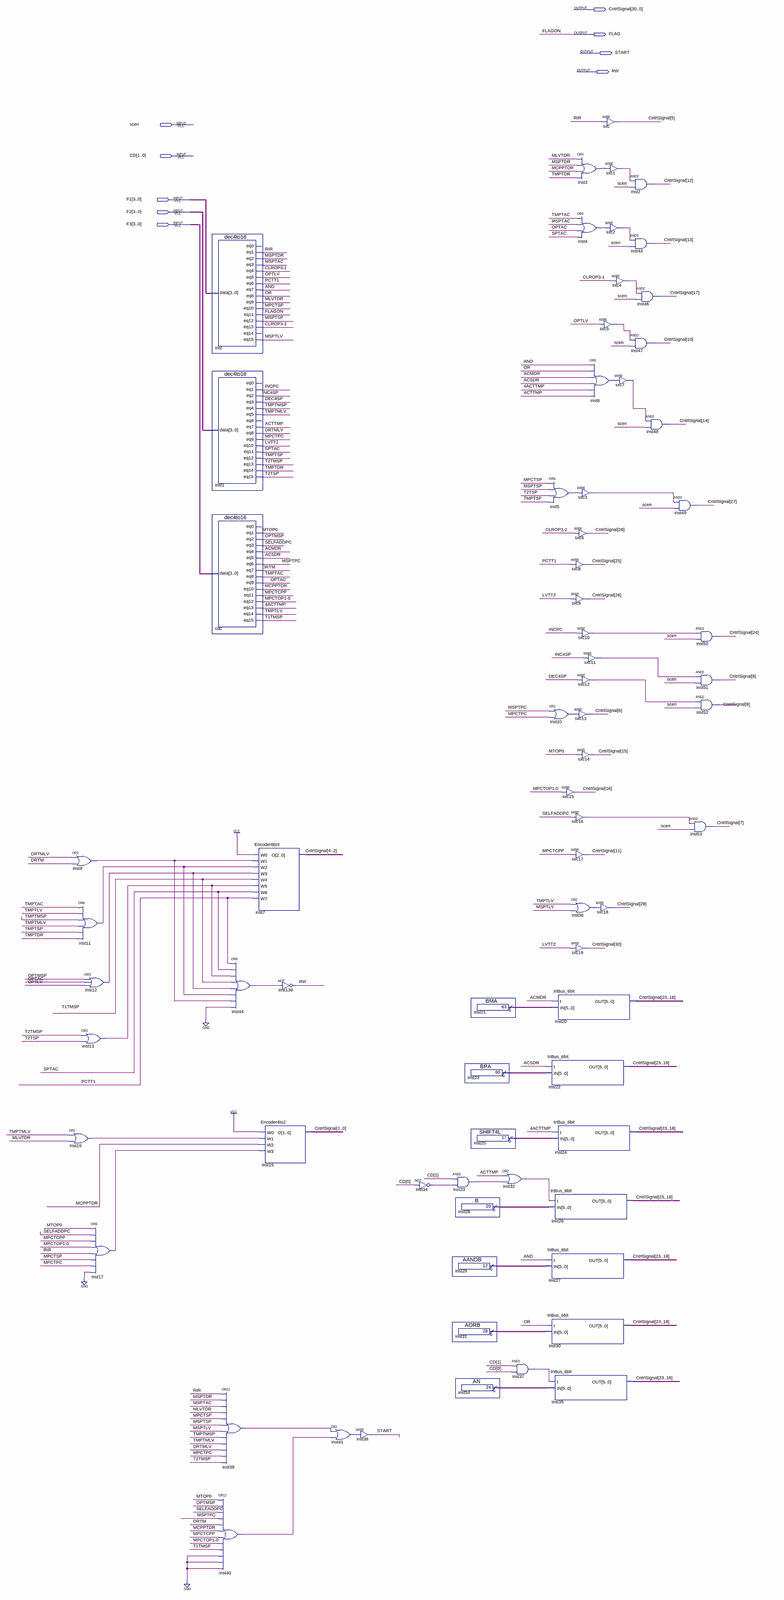
[diagram p0: schematic sheet, whole]
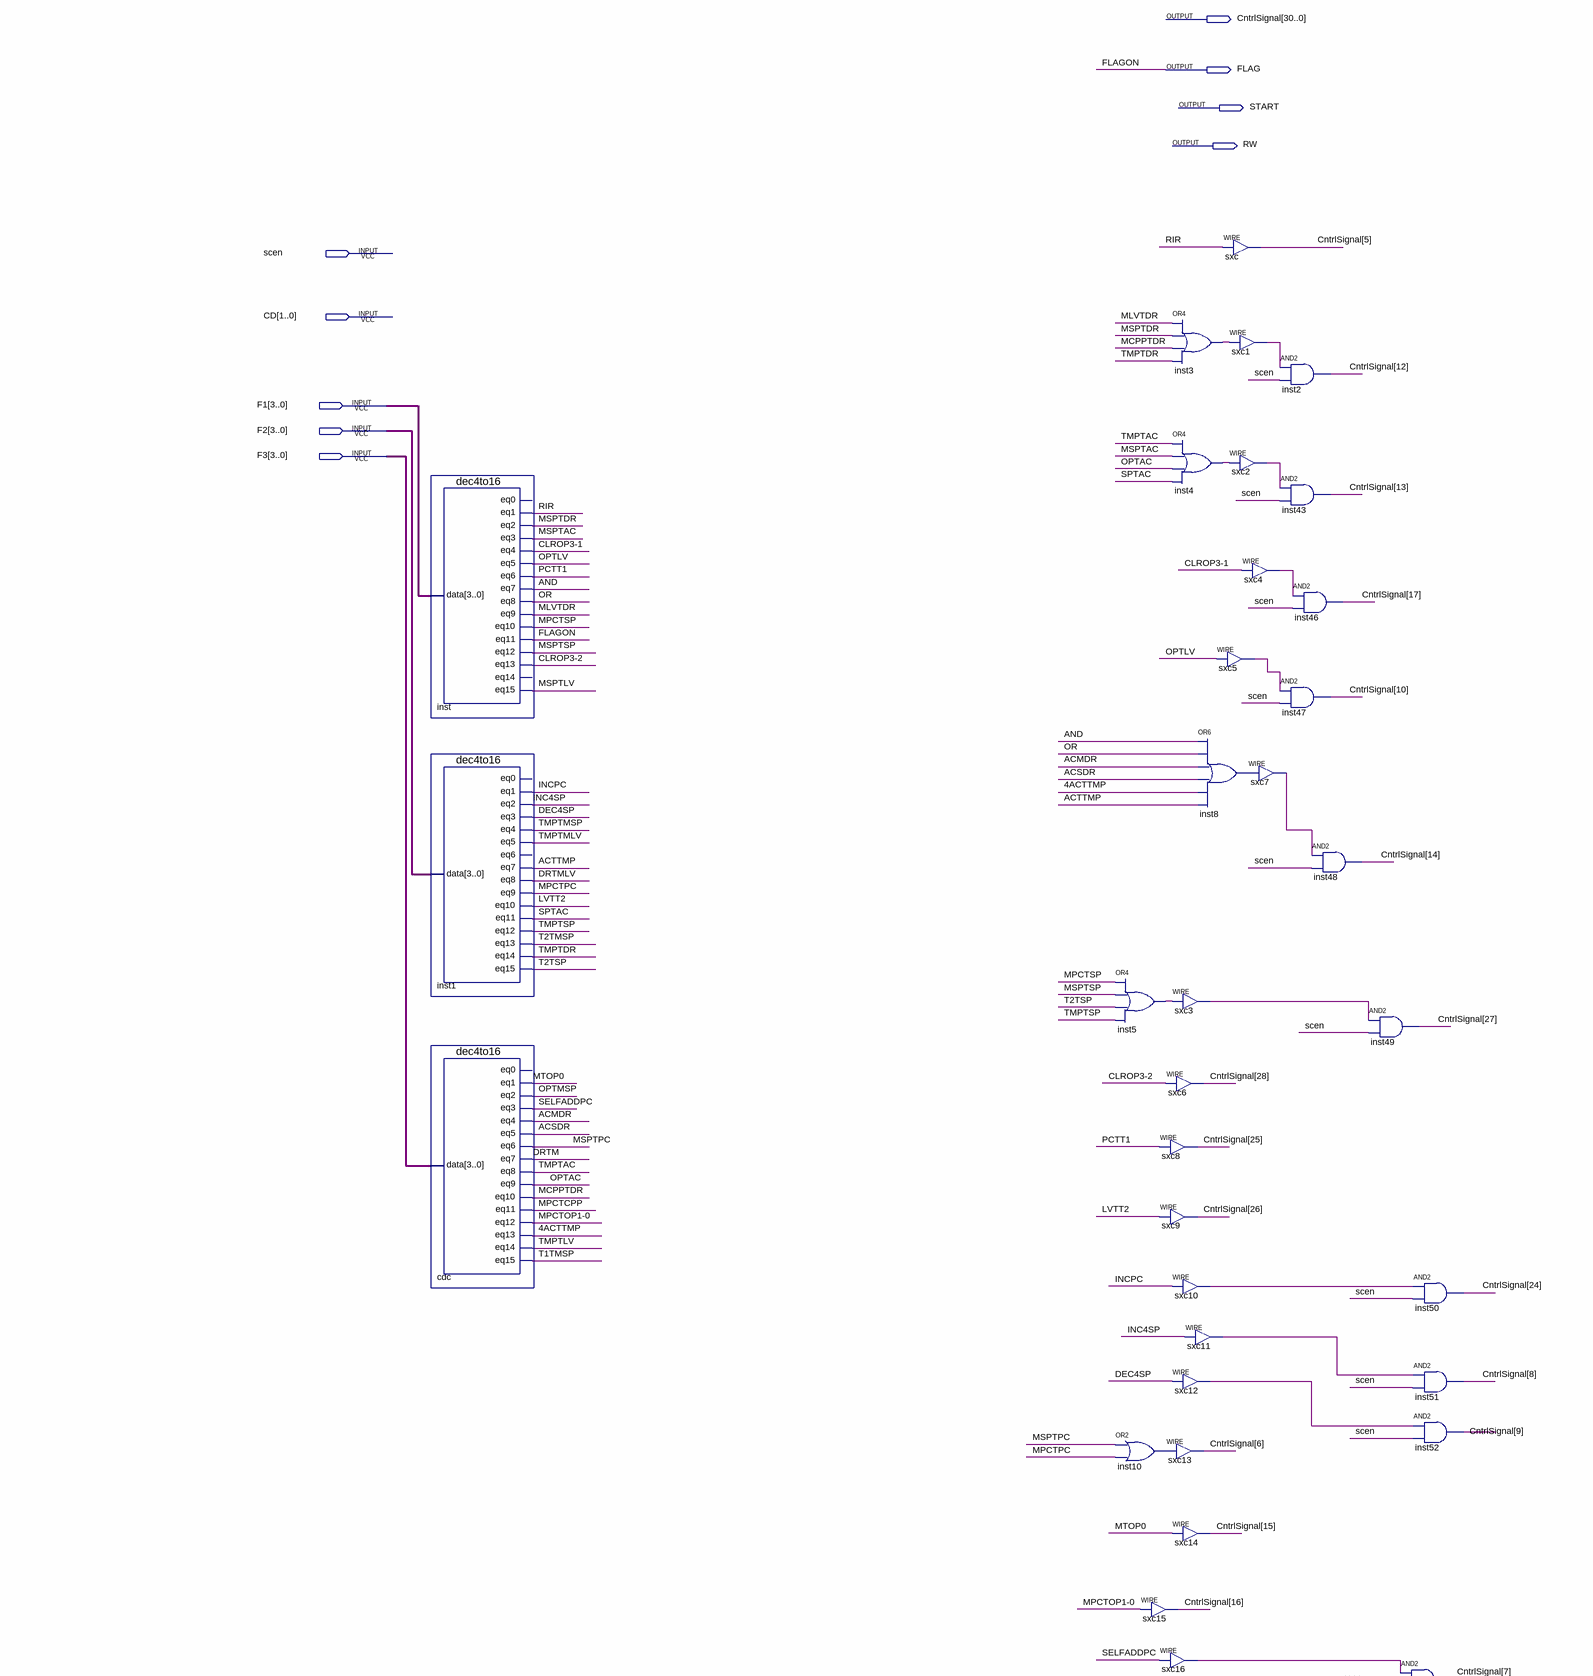
[diagram p1: schematic sheet, upper part]
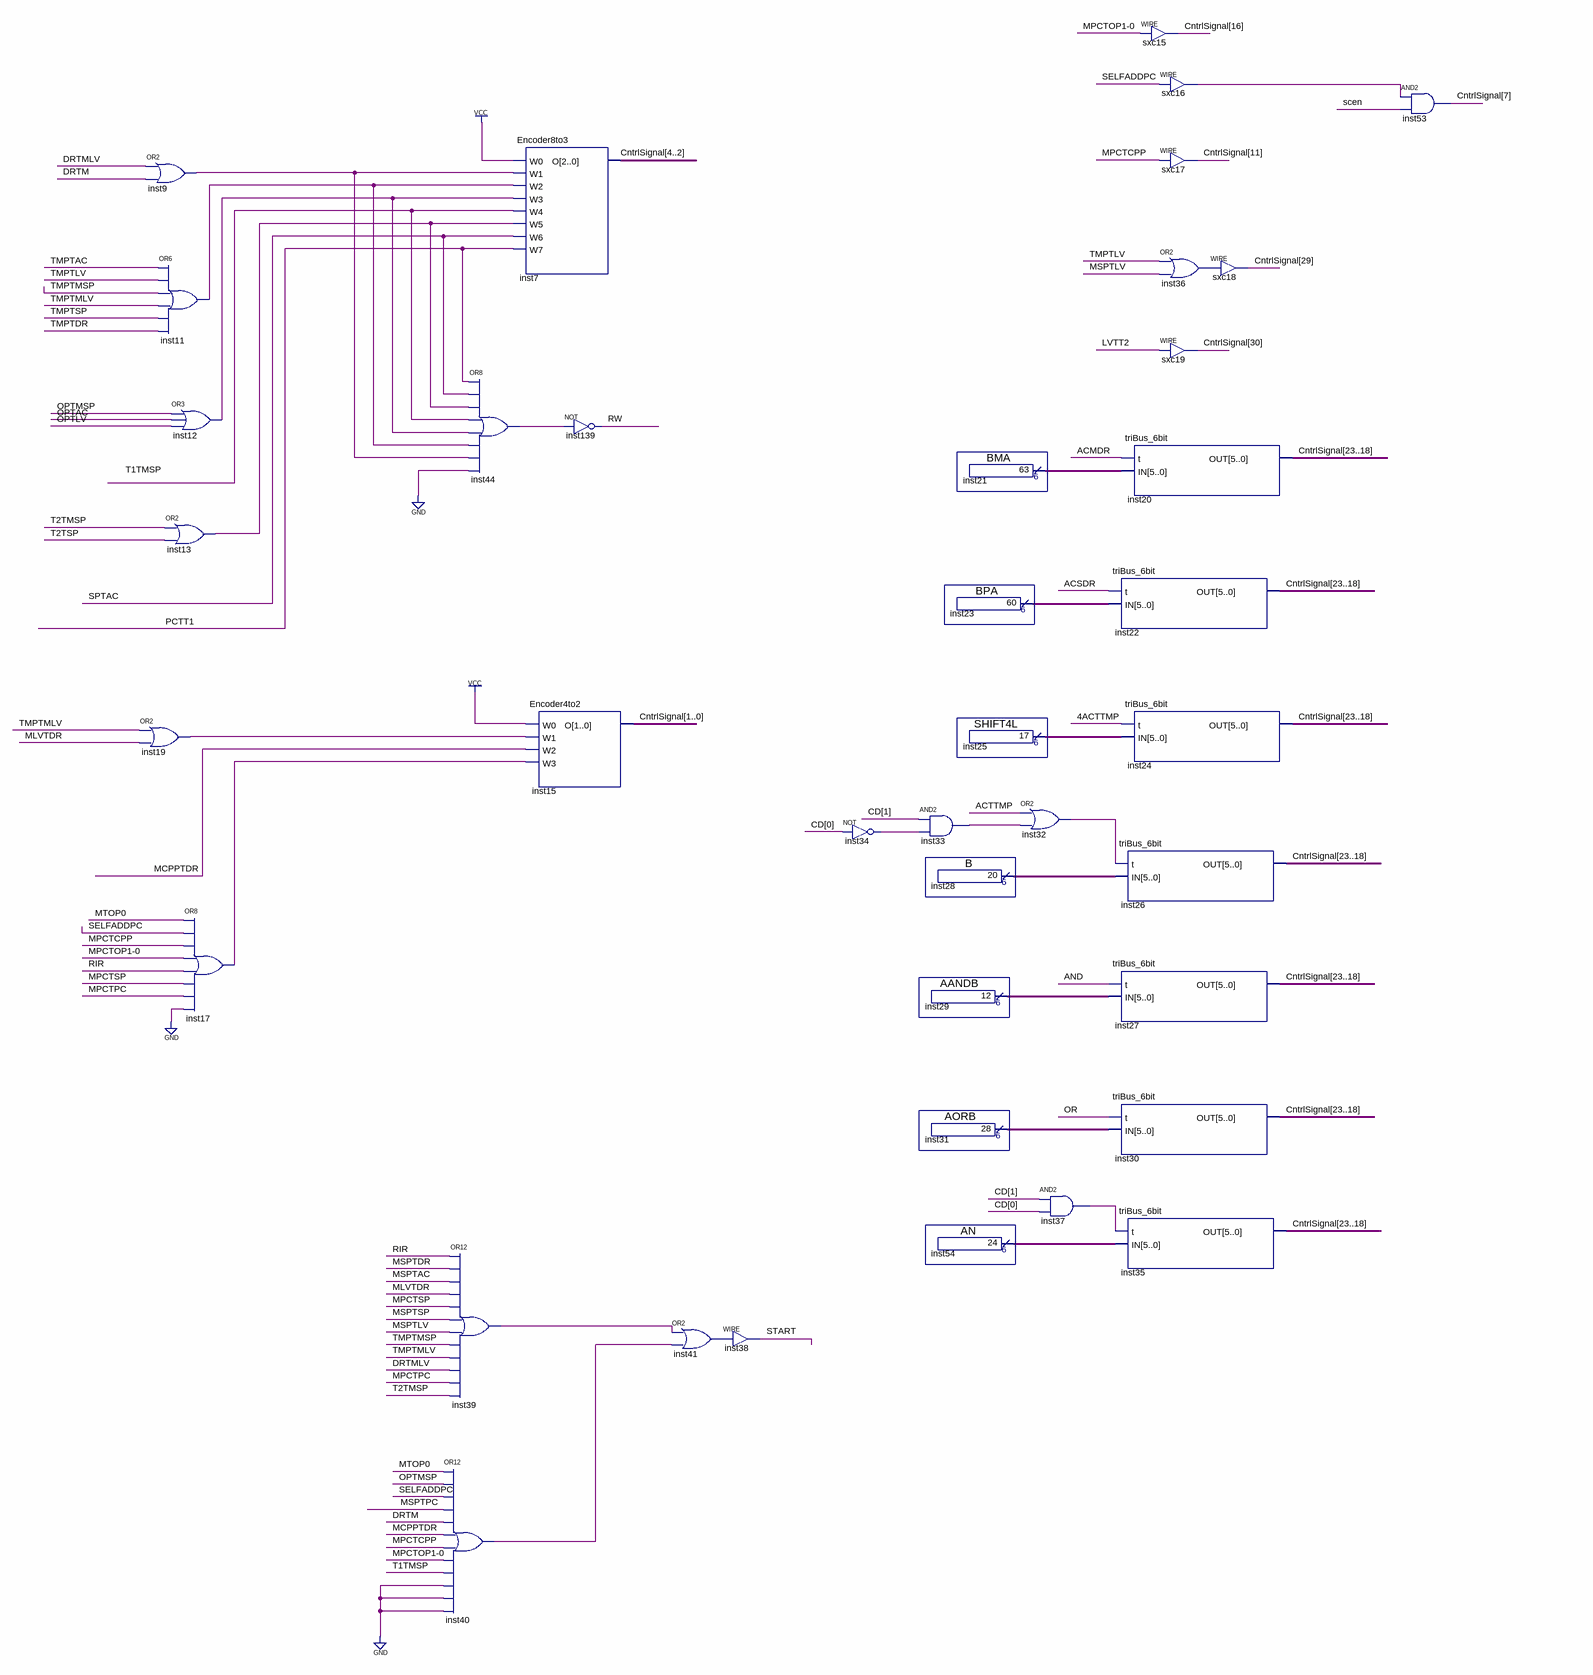
[diagram p2: schematic sheet, lower part]
// Quartus schematic GenSignals.bdf as structural Verilog: 71 symbols, 9 pins
module GenSignals (
  input  scen,
  input  [1:0] CD,
  input  [3:0] F1,
  input  [3:0] F2,
  input  [3:0] F3,
  output [30:0] CntrlSignal,
  output FLAG,
  output START,
  output RW
);

  wire \4ACTTMP , ACMDR, ACSDR, ACTTMP, AND, \CLROP3-1 , \CLROP3-2 , DEC4SP, DRTM, DRTMLV, INC4SP, INCPC,
       inst3_out, inst4_out, inst5_out, inst8_out, inst9_out, inst10_out, inst11_out, inst12_out, inst13_out,
       inst17_out, inst19_out, inst32_out, inst33_out, inst34_out, inst36_out, inst37_out, inst39_out,
       inst40_out, inst41_out, inst44_out, LVTT2, MCPPTDR, MLVTDR, MPCTCPP, \MPCTOP1-0 , MPCTPC, MPCTSP,
       MSPTAC, MSPTDR, MSPTLV, MSPTPC, MSPTSP, MTOP0, OPTAC, OPTLV, OPTMSP, OR, PCTT1, RIR, SELFADDPC, SPTAC,
       sxc1_out, sxc2_out, sxc3_out, sxc4_out, sxc5_out, sxc7_out, sxc10_out, sxc11_out, sxc12_out,
       sxc16_out, T1TMSP, T2TMSP, T2TSP, TMPTAC, TMPTDR, TMPTLV, TMPTMLV, TMPTMSP, TMPTSP;
  wire [5:0] inst21_result, inst23_result, inst25_result, inst28_result, inst29_result, inst31_result,
       inst54_result;

  or inst19 (inst19_out, TMPTMLV, MLVTDR);
  or inst9 (inst9_out, DRTMLV, DRTM);
  or inst11 (inst11_out, TMPTAC, TMPTLV, TMPTMSP, TMPTMLV, TMPTSP, TMPTDR);
  or inst12 (inst12_out, OPTMSP, OPTAC, OPTLV);
  or inst13 (inst13_out, T2TMSP, T2TSP);
  or inst17 (inst17_out, MTOP0, SELFADDPC, MPCTCPP, \MPCTOP1-0 , RIR, MPCTSP, MPCTPC, 1'b0);
  dec4to16 inst (
    .data(F1), .eq1(RIR), .eq2(MSPTDR), .eq3(MSPTAC), .eq4(\CLROP3-1 ), .eq5(OPTLV), .eq6(PCTT1), .eq7(AND),
    .eq8(OR), .eq9(MLVTDR), .eq10(MPCTSP), .eq11(FLAG), .eq12(MSPTSP), .eq13(\CLROP3-2 ), .eq15(MSPTLV));  // open: eq0, eq14
  dec4to16 inst1 (
    .data(F2), .eq1(INCPC), .eq2(INC4SP), .eq3(DEC4SP), .eq4(TMPTMSP), .eq5(TMPTMLV), .eq7(ACTTMP),
    .eq8(DRTMLV), .eq9(MPCTPC), .eq10(LVTT2), .eq11(SPTAC), .eq12(TMPTSP), .eq13(T2TMSP), .eq14(TMPTDR),
    .eq15(T2TSP));  // open: eq0, eq6
  dec4to16 cdc (
    .data(F3), .eq1(MTOP0), .eq2(OPTMSP), .eq3(SELFADDPC), .eq4(ACMDR), .eq5(ACSDR), .eq6(MSPTPC),
    .eq7(DRTM), .eq8(TMPTAC), .eq9(OPTAC), .eq10(MCPPTDR), .eq11(MPCTCPP), .eq12(\MPCTOP1-0 ),
    .eq13(\4ACTTMP ), .eq14(TMPTLV), .eq15(T1TMSP));  // open: eq0
  or inst40 (inst40_out, MTOP0, OPTMSP, SELFADDPC, MSPTPC, DRTM, MCPPTDR, MPCTCPP, \MPCTOP1-0 , T1TMSP, 1'b0, 1'b0, 1'b0);
  or inst44 (inst44_out, PCTT1, SPTAC, inst13_out, T1TMSP, inst12_out, inst11_out, inst9_out, 1'b0);
  or inst39 (inst39_out, RIR, MSPTDR, MSPTAC, MLVTDR, MPCTSP, MSPTSP, MSPTLV, TMPTMSP, TMPTMLV, DRTMLV, MPCTPC, T2TMSP);
  Encoder8to3 inst7 (
    .W0(1'b1), .W1(inst9_out), .W2(inst11_out), .W3(inst12_out), .W4(T1TMSP), .W5(inst13_out), .W6(SPTAC),
    .W7(PCTT1), .O(CntrlSignal[4:2]));
  Encoder4to2 inst15 (.W0(1'b1), .W1(inst19_out), .W2(MCPPTDR), .W3(inst17_out), .O(CntrlSignal[1:0]));
  not inst139 (RW, inst44_out);
  or inst41 (inst41_out, inst39_out, inst40_out);
  assign START = inst41_out;  // WIRE inst38
  not inst34 (inst34_out, CD[0]);
  BPA inst23 (.result(inst23_result));
  and inst33 (inst33_out, CD[1], inst34_out);
  B inst28 (.result(inst28_result));
  AANDB inst29 (.result(inst29_result));
  AORB inst31 (.result(inst31_result));
  AN inst54 (.result(inst54_result));
  BMA inst21 (.result(inst21_result));
  SHIFT4L inst25 (.result(inst25_result));
  or inst32 (inst32_out, ACTTMP, inst33_out);
  and inst37 (inst37_out, CD[1], CD[0]);
  or inst5 (inst5_out, MPCTSP, MSPTSP, T2TSP, TMPTSP);
  or inst10 (inst10_out, MSPTPC, MPCTPC);
  assign CntrlSignal[16] = \MPCTOP1-0 ;  // WIRE sxc15
  triBus_6bit inst20 (.t(ACMDR), .IN(inst21_result), .OUT(CntrlSignal[23:18]));
  triBus_6bit inst22 (.t(ACSDR), .IN(inst23_result), .OUT(CntrlSignal[23:18]));
  triBus_6bit inst24 (.t(\4ACTTMP ), .IN(inst25_result), .OUT(CntrlSignal[23:18]));
  triBus_6bit inst26 (.t(inst32_out), .IN(inst28_result), .OUT(CntrlSignal[23:18]));
  triBus_6bit inst27 (.t(AND), .IN(inst29_result), .OUT(CntrlSignal[23:18]));
  triBus_6bit inst30 (.t(OR), .IN(inst31_result), .OUT(CntrlSignal[23:18]));
  triBus_6bit inst35 (.t(inst37_out), .IN(inst54_result), .OUT(CntrlSignal[23:18]));
  or inst3 (inst3_out, MLVTDR, MSPTDR, MCPPTDR, TMPTDR);
  or inst4 (inst4_out, TMPTAC, MSPTAC, OPTAC, SPTAC);
  or inst8 (inst8_out, AND, OR, ACMDR, ACSDR, \4ACTTMP , ACTTMP);
  assign sxc3_out = inst5_out;  // WIRE sxc3
  assign CntrlSignal[28] = \CLROP3-2 ;  // WIRE sxc6
  assign CntrlSignal[25] = PCTT1;  // WIRE sxc8
  assign CntrlSignal[26] = LVTT2;  // WIRE sxc9
  assign sxc10_out = INCPC;  // WIRE sxc10
  assign sxc11_out = INC4SP;  // WIRE sxc11
  assign sxc12_out = DEC4SP;  // WIRE sxc12
  assign CntrlSignal[6] = inst10_out;  // WIRE sxc13
  assign CntrlSignal[15] = MTOP0;  // WIRE sxc14
  assign sxc16_out = SELFADDPC;  // WIRE sxc16
  assign CntrlSignal[11] = MPCTCPP;  // WIRE sxc17
  or inst36 (inst36_out, TMPTLV, MSPTLV);
  assign CntrlSignal[30] = LVTT2;  // WIRE sxc19
  assign CntrlSignal[5] = RIR;  // WIRE sxc
  assign sxc1_out = inst3_out;  // WIRE sxc1
  assign sxc2_out = inst4_out;  // WIRE sxc2
  assign sxc4_out = \CLROP3-1 ;  // WIRE sxc4
  assign sxc5_out = OPTLV;  // WIRE sxc5
  assign sxc7_out = inst8_out;  // WIRE sxc7
  assign CntrlSignal[29] = inst36_out;  // WIRE sxc18
  and inst2 (CntrlSignal[12], sxc1_out, scen);
  and inst43 (CntrlSignal[13], sxc2_out, scen);
  and inst46 (CntrlSignal[17], sxc4_out, scen);
  and inst47 (CntrlSignal[10], sxc5_out, scen);
  and inst48 (CntrlSignal[14], sxc7_out, scen);
  and inst49 (CntrlSignal[27], sxc3_out, scen);
  and inst53 (CntrlSignal[7], sxc16_out, scen);
  and inst50 (CntrlSignal[24], sxc10_out, scen);
  and inst51 (CntrlSignal[8], sxc11_out, scen);
  and inst52 (CntrlSignal[9], sxc12_out, scen);

  // Other names for the same wires on the sheet: FLAGON = FLAG
endmodule
